# EAGLE design Cytrill (EAGLE 6.5.0)
DATABASE: ./parts-db.csv
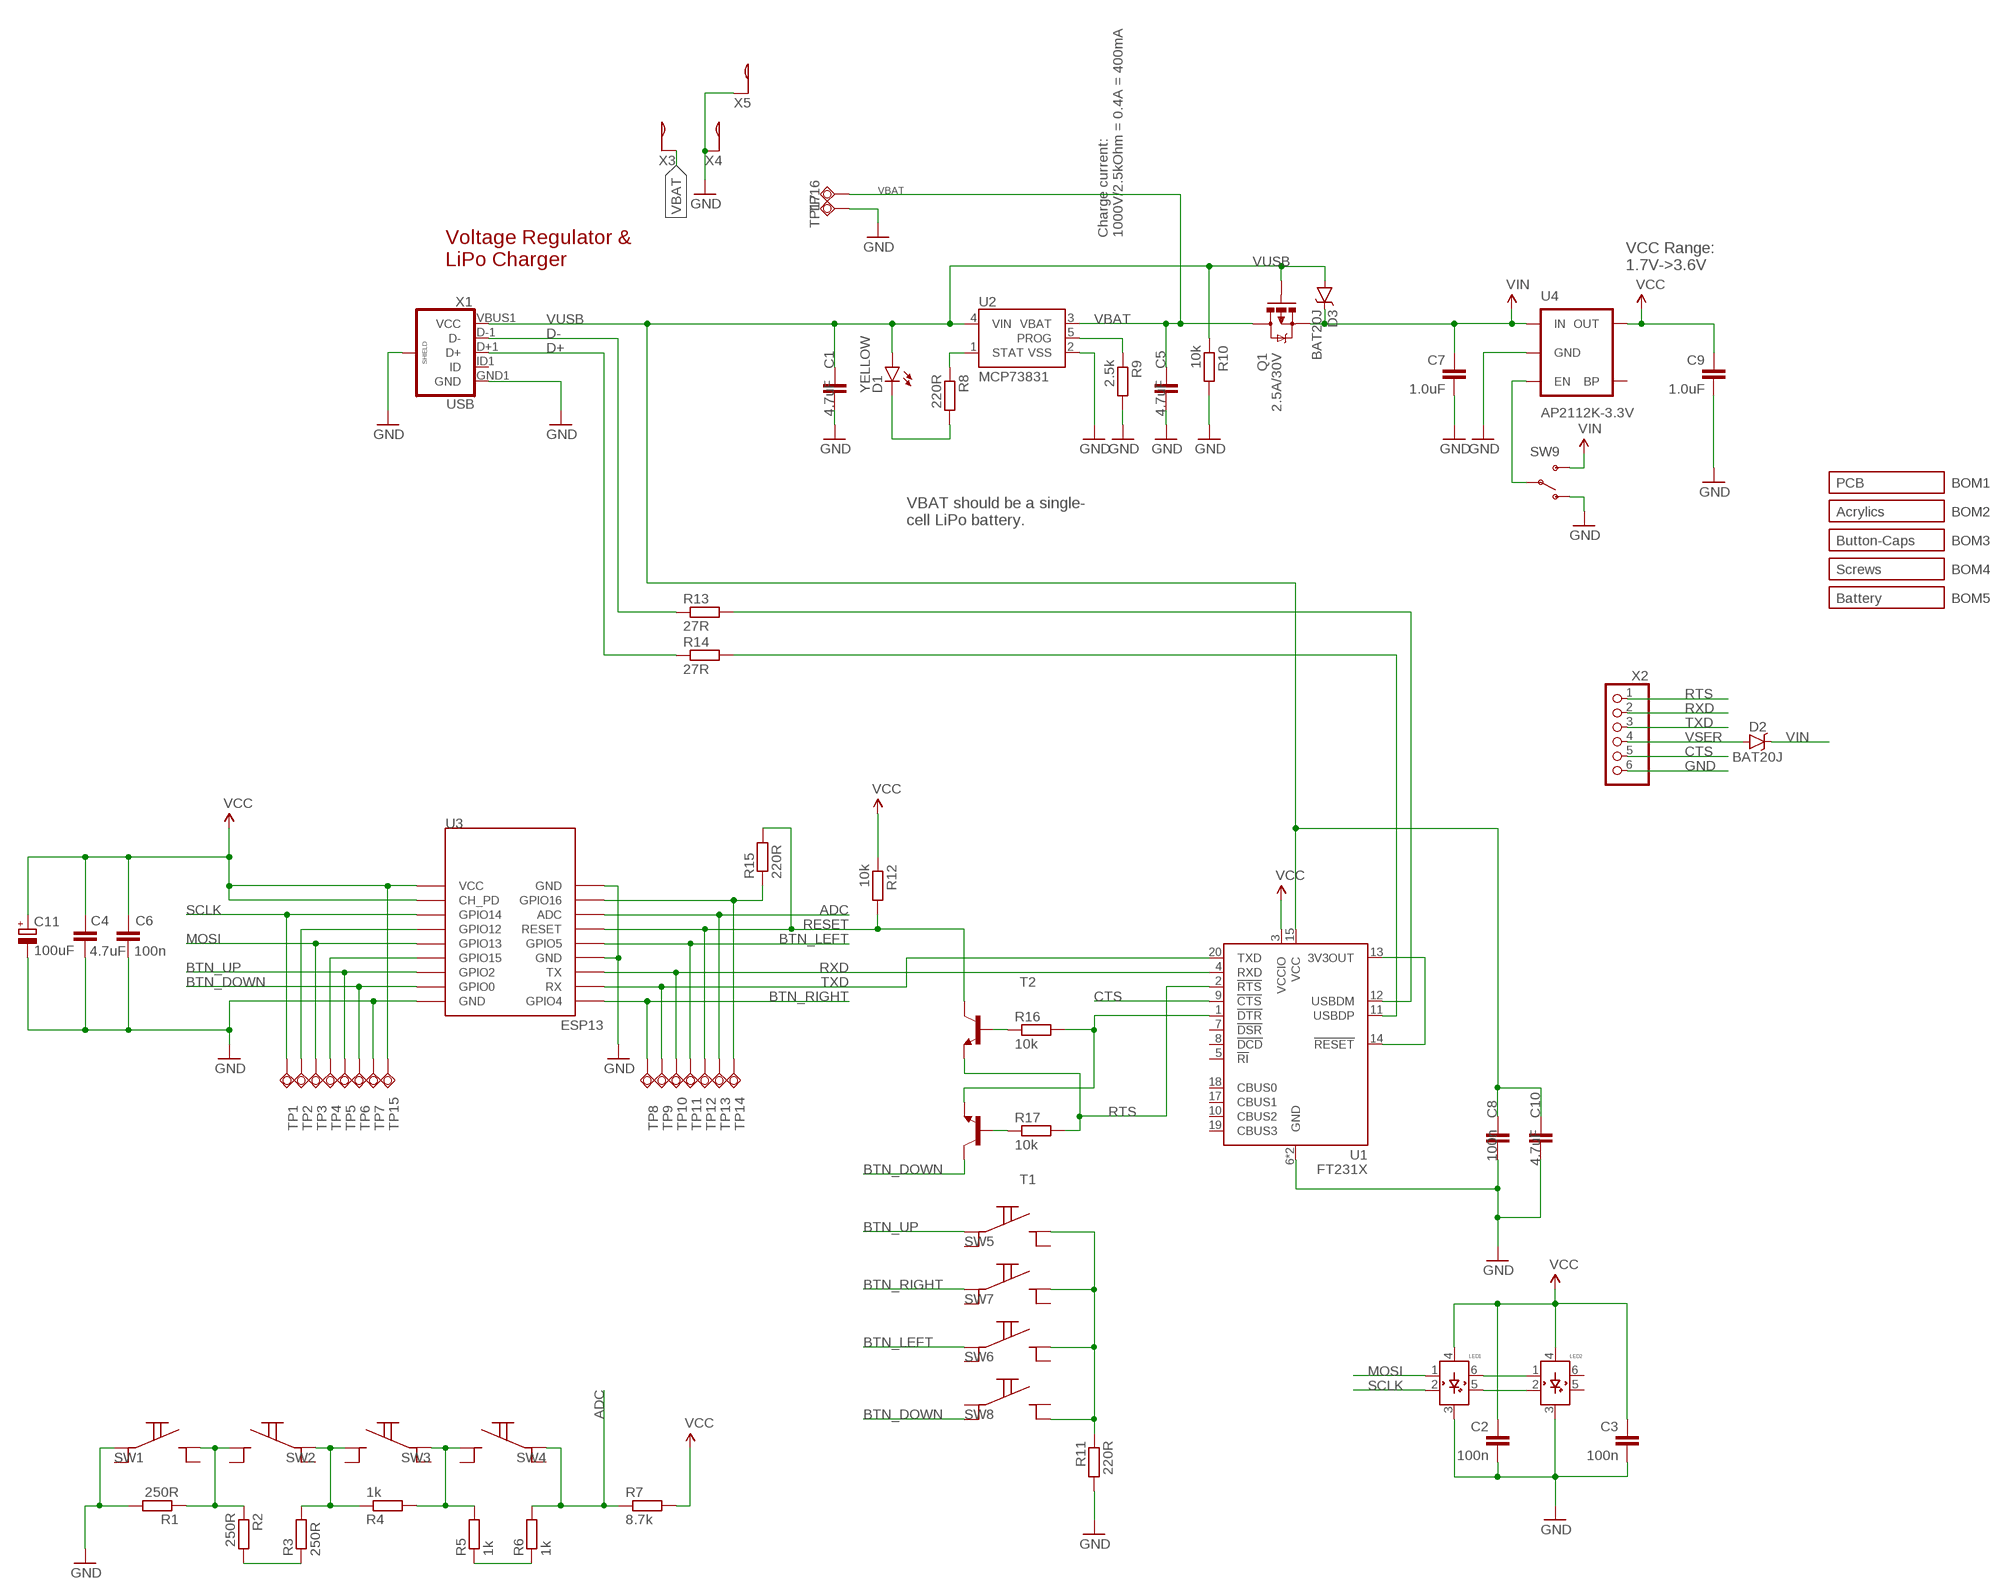
[diagram p0: schematic, sheet 1]
BOM1 (BOM-ENTRY): PARTNO: PCB100x36
BOM2 (BOM-ENTRY): PARTNO: ACRYLICS
BOM3 (BOM-ENTRY): PARTNO: TACTCAPS
BOM4 (BOM-ENTRY): PARTNO: SCREWS
BOM5 (BOM-ENTRY): PARTNO: BATTERY-AAA

## Parts
C1  4.7uF  C-EUC0603  [C0603]
C2  100n  C-EUC0603  [C0603]
C3  100n  C-EUC0603  [C0603]
C4  4.7uF  C-EUC0603  [C0603]
C5  4.7uF  C-EUC0603  [C0603]
C6  100n  C-EUC0603  [C0603]
C7  1.0uF  C-EUC0603  [C0603]
C8  100n  C-EUC0603  [C0603]
C9  1.0uF  C-EUC0603  [C0603]
C10  4.7uF  C-EUC0603  [C0603]
C11  100uF  CPOL-EU085CS-1AR  [3216-A]
D1  YELLOW  LED-YELLOW0603  [LED-0603]
D2  BAT20J  DIODE-SCHOTTKY-BAT20J  [SOD-323]
D3  BAT20J  DIODE-SCHOTTKY-BAT20J  [SOD-323]
LED1  APA102  [RGBLED5050]
LED2  APA102  [RGBLED5050]
Q1  2.5A/30V  MOSFET-PCHANNELDMG2307L  [SOT23-3]
R1  250R  R-EU_R0603  [R0603]
R2  250R  R-EU_R0603  [R0603]
R3  250R  R-EU_R0603  [R0603]
R4  1k  R-EU_R0603  [R0603]
R5  1k  R-EU_R0603  [R0603]
R6  1k  R-EU_R0603  [R0603]
R7  8.7k  R-EU_R0603  [R0603]
R8  220R  R-EU_R0603  [R0603]
R9  2.5k  R-EU_R0603  [R0603]
R10  10k  R-EU_R0603  [R0603]
R11  220R  R-EU_R0603  [R0603]
R12  10k  R-EU_R0603  [R0603]
R13  27R  R-EU_R0603  [R0603]
R14  27R  R-EU_R0603  [R0603]
R15  220R  R-EU_R0603  [R0603]
R16  10k  R-EU_R0603  [R0603]
R17  10k  R-EU_R0603  [R0603]
SW1  TACTSWITCH6MM  [TACTSWITCH]
SW2  TACTSWITCH6MM  [TACTSWITCH]
SW3  TACTSWITCH6MM  [TACTSWITCH]
SW4  TACTSWITCH6MM  [TACTSWITCH]
SW5  TACTSWITCH6MM  [TACTSWITCH]
SW6  TACTSWITCH6MM  [TACTSWITCH]
SW7  TACTSWITCH6MM  [TACTSWITCH]
SW8  TACTSWITCH6MM  [TACTSWITCH]
SW9  SWITCH-SPDT-SMD-A  [SWITCH-SPST-SMD-A]
T1  BC847C-NPN-SOT23-BEC  [SOT23-BEC]
T2  BC847C-NPN-SOT23-BEC  [SOT23-BEC]
TP1  TPSQTP15SQ  [TP15SQ]
TP2  TPSQTP15SQ  [TP15SQ]
TP3  TPSQTP15SQ  [TP15SQ]
TP4  TPSQTP15SQ  [TP15SQ]
TP5  TPSQTP15SQ  [TP15SQ]
TP6  TPSQTP15SQ  [TP15SQ]
TP7  TPSQTP15SQ  [TP15SQ]
TP8  TPSQTP15SQ  [TP15SQ]
TP9  TPSQTP15SQ  [TP15SQ]
TP10  TPSQTP15SQ  [TP15SQ]
TP11  TPSQTP15SQ  [TP15SQ]
TP12  TPSQTP15SQ  [TP15SQ]
TP13  TPSQTP15SQ  [TP15SQ]
TP14  TPSQTP15SQ  [TP15SQ]
TP15  TPSQTP15SQ  [TP15SQ]
TP16  TPSQTP20R  [TP20R]
TP17  TPSQTP20R  [TP20R]
U1  FT231X  [SSOP20]
U2  MCP73831  [SOT23-5]
U3  ESP13  [ESP13]
U4  AP2112K-3.3V  V_REG_LDOSMD  [SOT23-5]
X1  USB  USB_MICROB_PLUGCONN-11752  [USB-B-MICRO-SMD_V03]
X2  PINHD-1X6/90-SMD  [1X06/90-SMD]
X3  BATTERYTERMINAL  [KEYSTONE-55]
X4  BATTERYTERMINAL  [KEYSTONE-55]
X5  BATTERYTERMINAL  [KEYSTONE-55]

## Nets
ADC: R6.2 R7.1 SW4.A@1(A) TP13.TP U3.ADC
BTN_DOWN: SW8.A@2(A1) T1.3(C) TP6.TP U3.GPIO0
BTN_LEFT: SW6.A@1(A) TP11.TP U3.GPIO5
BTN_RIGHT: SW7.A@1(A) TP8.TP U3.GPIO4
BTN_UP: SW5.A@1(A) TP5.TP U3.GPIO2
CTS: U1.9(!CTS) X2.5
D+: R14.1 X1.D+1(D+)
D-: R13.1 X1.D-1(D-)
GND: C1.2 C2.2 C3.2 C4.2 C5.2 C6.2 C7.2 C8.2 C9.2 C10.2 C11.- LED1.3(GND) LED2.3(GND) R1.2 R9.2 R10.2 R11.2 SW1.A@1(A) SW9.1(O) TP7.TP TP17.TP U1.6(GND) U1.16(GND) U2.2(VSS) U3.GND@0(GND) U3.GND@1(GND) U3.GND@2(GND) U4.2(GND) X1.GND1(GND) X1.SHIELD1(SHIELD) X1.SHIELD2(SHIELD) X2.6 X4.1@1 X4.1@2 X5.1@1 X5.1@2
MOSI: LED1.1(DIN) TP3.TP U3.GPIO13
N$1: LED1.6(DOUT) LED2.1(DIN)
N$2: LED1.5(COUT) LED2.2(CIN)
N$3: R11.1 SW5.B@1(B) SW6.B@1(B) SW7.B@1(B) SW8.B@2(B1)
N$4: R14.2 U1.11(USBDP)
N$5: R15.1 TP14.TP U3.GPIO16
N$6: R1.1 R2.1 SW1.B@1(B) SW2.B@1(B)
N$7: R3.2 R4.1 SW2.A@1(A) SW3.B@1(B)
N$8: R4.2 R5.2 SW3.A@1(A) SW4.B@1(B)
N$9: R13.2 U1.12(USBDM)
N$10: U1.13(3V3OUT) U1.14(!RESET)
N$11: SW9.2(P) U4.3(EN)
N$12: R16.1 T2.1(B)
N$13: R5.1 R6.1
N$14: R9.1 U2.5(PROG)
N$15: R2.2 R3.1
N$16: TP2.TP U3.GPIO12
N$17: D1.C R8.2
N$18: R8.1 U2.1(STAT)
N$19: TP4.TP U3.GPIO15
N$21: R17.1 T1.1(B)
N$23: R16.2 T1.2(E) U1.1(!DTR)
RESET: R12.2 R15.2 T2.3(C) TP12.TP U3.RST(RESET)
RTS: R17.2 T2.2(E) U1.2(!RTS) X2.1
RXD: TP10.TP U1.4(RXD) U3.TXD(TX) X2.2
SCLK: LED1.2(CIN) TP1.TP U3.GPIO14
TXD: TP9.TP U1.20(TXD) U3.RXD(RX) X2.3
VBAT: C5.1 Q1.3(D) TP16.TP U2.3(VBAT) X3.1@1 X3.1@2
VCC: C2.1 C3.1 C4.1 C6.1 C9.1 C11.+ LED1.4(VDD) LED2.4(VDD) R7.2 R12.1 TP15.TP U1.3(VCCIO) U3.CH_PD U3.VCC U4.5(OUT)
VIN: C7.1 D2.C D3.C Q1.2(S) SW9.3(S) U4.1(IN)
VSER: D2.A X2.4
VUSB: C1.1 C8.1 C10.1 D1.A D3.A Q1.1(G) R10.1 U1.15(VCC) U2.4(VIN) X1.VBUS1(VCC)
Unconnected: LED2.5(COUT) LED2.6(DOUT) SW1.A@2(A1) SW1.B@2(B1) SW2.A@2(A1) SW2.B@2(B1) SW3.A@2(A1) SW3.B@2(B1) SW4.A@2(A1) SW4.B@2(B1) SW5.A@2(A1) SW5.B@2(B1) SW6.A@2(A1) SW6.B@2(B1) SW7.A@2(A1) SW7.B@2(B1) SW8.A@1(A) SW8.B@1(B) U1.5(!RI) U1.7(!DSR) U1.8(!DCD) U1.10(CBUS2) U1.17(CBUS1) U1.18(CBUS0) U1.19(CBUS3) U4.4(BP) X1.ID1(ID)

## Notes on the sheet
- Charge current:
  1000V/2.5kOhm = 0.4A = 400mA
- Voltage Regulator &
  LiPo Charger
- VCC Range:
  1.7V->3.6V
- VBAT should be a single-
  cell LiPo battery.

## Library data of the parts
C1 C4 C5 C10 = Cytrill:C-EU: CAPACITOR, European symbol; PARTNO: GRM188R61A475KE15D-MO
C2 C3 C6 C8 = Cytrill:C-EU: CAPACITOR, European symbol; PARTNO: C0603C104K4RACTU-MO
C7 C9 = Cytrill:C-EU: CAPACITOR, European symbol; PARTNO: GRM188R61E105KA12D-MO
C11 = Cytrill:CPOL-EU: POLARIZED CAPACITOR, European symbol; PARTNO: TANTAL100UF
D1 = Cytrill:LED-YELLOW: Yellow SMD LEDs LilyPad 1206- DIO-09909 0603- DIO-09003; PARTNO: LYQ396P1Q236-MO; PROD_ID: DIO-09003
D2 D3 = Cytrill:DIODE-SCHOTTKY: Schottky diodes in SFE's production catalog BAT20J 1A 23V 0.62Vf RB751 120mA 40V 0.37Vf PMEG4005EJ 0.5A 40V 0.42Vf MBRA140 1A 40V 0.5Vf B340A 3A 40V SMA; PARTNO: BAT20JFILM-MO; PROD_ID: DIO-11623
LED1 LED2 = Cytrill:APA102; PARTNO: APA102
Q1 = Cytrill:MOSFET-PCHANNEL: Generic PMOSFET IRLML2244 - TRANS-11153 (SOT-23 -20V -4.3A) (1.Gate 2.Source 3.Drain) FQP27P06 - COM-10349 <http://www.sparkfun.com/products/10349> (TO-220 -60V -27A) (1.Gate 2.Source 3.Drain); PARTNO: DMP3130L-7-MO; PROD_ID: TRANS-11308
R1-R3 = Cytrill:R-EU_: RESISTOR, European symbol; PARTNO: ERJ3EKF2490V-MO
R4-R6 = Cytrill:R-EU_: RESISTOR, European symbol; PARTNO: ERJ3EKF1001V-MO
R7 = Cytrill:R-EU_: RESISTOR, European symbol; PARTNO: ERJ3EKF8661V-MO
R8 R11 R15 = Cytrill:R-EU_: RESISTOR, European symbol; PARTNO: ERJ3EKF2200V-MO
R9 = Cytrill:R-EU_: RESISTOR, European symbol; PARTNO: ERJ3EKF2491V-MO
R10 R12 R16 R17 = Cytrill:R-EU_: RESISTOR, European symbol; PARTNO: ERJ3EKF1002V-MO
R13 R14 = Cytrill:R-EU_: RESISTOR, European symbol; PARTNO: ERJ3EKF27R0V-MO
SW1-SW8 = Cytrill:TACTSWITCH; PARTNO: 101-0364-EV-MO
SW9 = Cytrill:SWITCH-SPDT: SPDT Switch Simple slide switch, Spark Fun Electronics SKU : COM-00102 DPDT SMT slide switch, AYZ0202, SWCH-08179; PARTNO: SSSS810701; PROD_ID: SWCH-10651
T1 T2 = Cytrill:*-NPN-: NPN Transistror BF959 corrected 2008.03.06; PARTNO: BC847C-MO
TP1-TP17 = Cytrill:TPSQ: Test pad; PARTNO: TESTPAD
U1 = Cytrill:FT231X; PARTNO: FT231XS
U2 = Cytrill:MCP73831: Miniature single cell, fully integrated Li-Ion, Li-polymer charge management controller http://ww1.microchip.com/downloads/en/DeviceDoc/21984a.pdf IC-09995; PARTNO: MCP73831T-2ATI/OT; PROD_ID: IC-09995
U3 = Cytrill:ESP13; PARTNO: esp-13
U4 = Cytrill:V_REG_LDO: Voltage Regulator LDO Standard 150mA LDO voltage regulator in SOT-23 layout. Micrel part MIC5205. BP (by-pass) pin is used to lower output noise with 470pF cap.; PARTNO: AP2112K-3.3; PROD_ID: VREG-12457
X1 = Cytrill:USB_MICROB_PLUG: USB Micro-B connectors Some male, some female. Watch your step!; PROD_ID: CONN-11752
X2 = Cytrill:PINHD-1X6: PIN HEADER; PARTNO: 961106-5500-AR-PR-MO
X3-X5 = Cytrill:BATTERYTERMINAL; PARTNO: KS55-MO

## Board
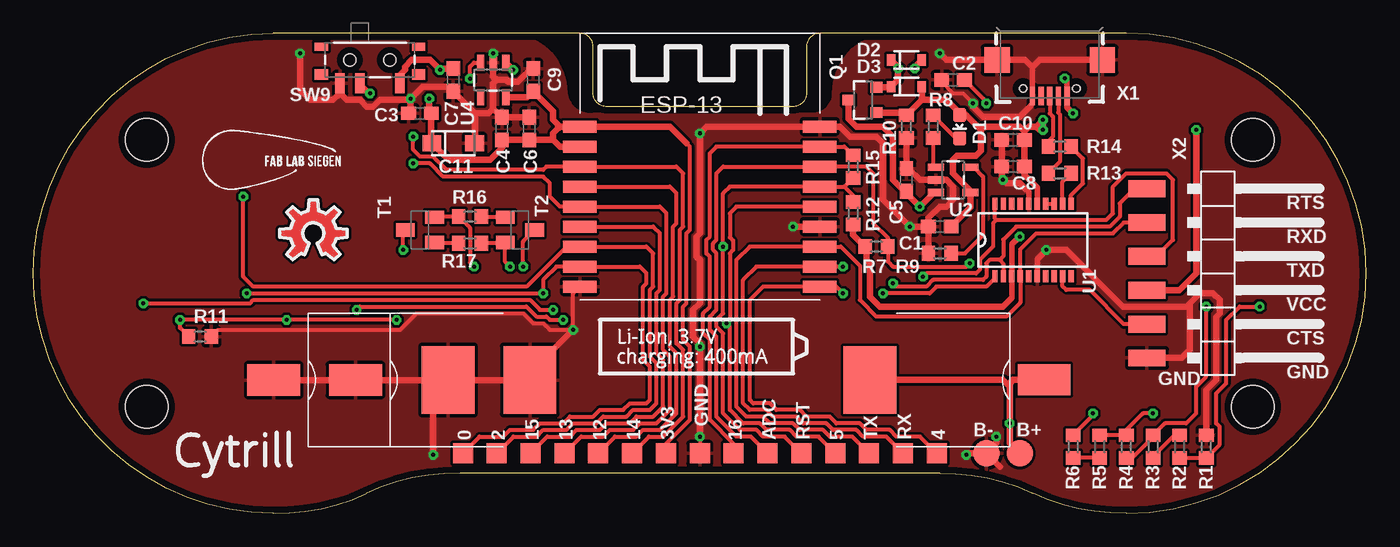
[diagram p1: board, top side]
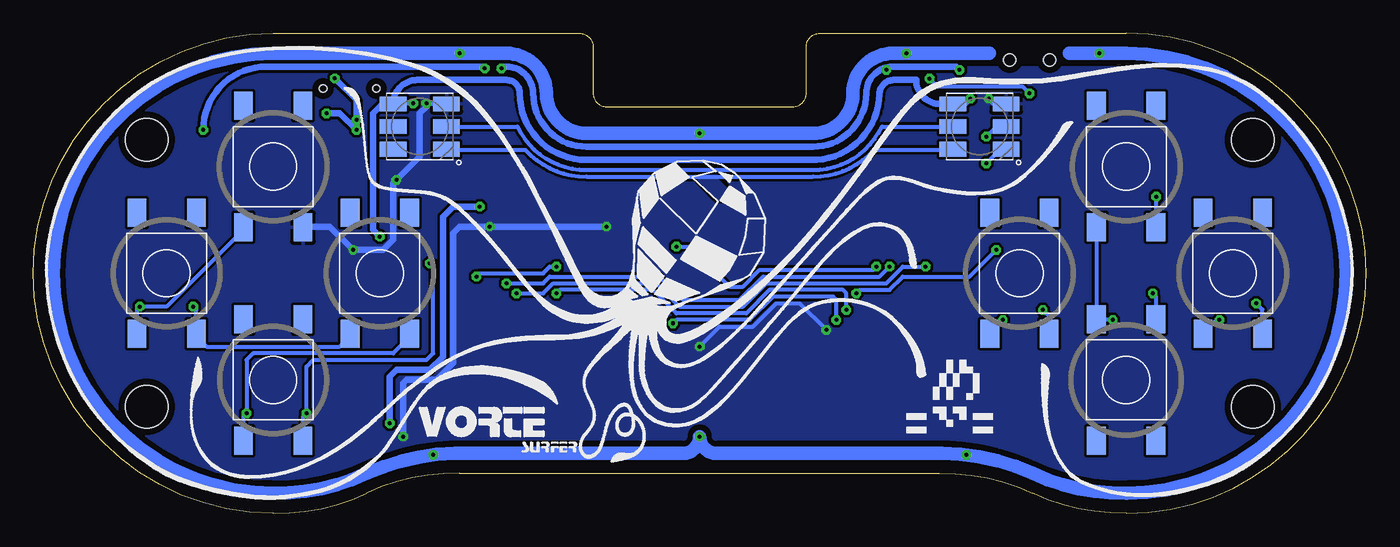
[diagram p2: board, bottom side, seen from below]

Size 100.01 x 36 mm. Coordinates in mm from the lower left corner, seen from the top.
Outline: 59.01,36 arc90 58.01,35 58.01,31.5 arc-90 57.01,30.5 43.01,30.5 arc-90 42.01,31.5 42.01,35 arc90 41.01,36 18.01,36 arc90 0,18 arc90 18.01,0 arc27 25.01,1.5 arc-27 32.01,3 68.01,3 arc-27 75.01,1.5 arc27 82.01,0 arc180 82.01,36 59.01,36
Copper layers (1*16): Top 0.035mm / dielectric 1.5mm / Bottom 0.035mm
Design rules "default *": minimum track width 0.15mm, minimum drill 0.3mm, track to track 0.2mm, track to pad 0.2mm, pad to pad 0.2mm, via to via 0.2mm, smd to smd 0mil, copper to edge 0.5mm, drill to drill 8mil, minimum pad ring 10mil, minimum via ring 8mil, stop-mask expansion 4mil, vias tented up to drill 0.3mm, thermal gap 10mil
Holes 3.2 mm at 91.51,8 91.51,28 8.51,28 8.51,8

### Footprints (pad centres in the part's own frame; a part is rotated, then mirrored left to right if it is on the bottom)
C0603 = smd 1.1 x 1: 1 -0.85,0; 2 0.85,0
3216-A = smd 1.4 x 1.2: + 1.6,0; - -1.6,0
LED-0603 = smd 1 x 1: A 0,-0.877; C 0,0.877
SOD-323 = smd 0.63 x 0.83: A 1.15,0; C -1.15,0
RGBLED5050 = smd 2 x 1.1: 1 -2,1.7; 2 -2,0; 3 -2,-1.7; 4 2,-1.7; 5 2,0; 6 2,1.7
SOT23-3 = smd 0.8 x 0.9: 1 -0.95,-1; 2 0.95,-1; 3 0,1.1
R0603 = smd 1 x 1.1: 1 -0.85,0; 2 0.85,0
TACTSWITCH = smd 2.1 x 1.4: A@1 -4.55,-2.23; A@2 4.55,-2.23; B@1 -4.55,2.23; B@2 4.55,2.23
SWITCH-SPST-SMD-A = smd 0.7 x 1.5: 1 -2.25,-1.75; 2 -0.75,-1.75; 3 2.25,-1.75 | smd 1 x 0.6: GND1 -3.65,1; GND3 3.65,1 | smd 1 x 0.8: GND2 -3.65,-1.1; GND4 3.65,-1.1 | hole 0.9: -1.5,0; 1.5,0
SOT23-BEC = smd 1 x 1.4: 1 -0.95,-1.1; 2 0.95,-1.1; 3 0,1.1
TP15SQ = smd 1.5 x 1.5: TP 0,0
TP20R = smd 2 x 2: TP 0,0
SSOP20 = smd 0.914 x 0.406: 1 -2.718,2.857; 2 -2.718,2.223; 3 -2.718,1.587; 4 -2.718,0.953; 5 -2.718,0.318; 6 -2.718,-0.318; 7 -2.718,-0.953; 8 -2.718,-1.587; 9 -2.718,-2.223; 10 -2.718,-2.857; 11 2.718,-2.857; 12 2.718,-2.223; 13 2.718,-1.587; 14 2.718,-0.953; 15 2.718,-0.318; 16 2.718,0.318; 17 2.718,0.953; 18 2.718,1.587; 19 2.718,2.223; 20 2.718,2.857
SOT23-5 = smd 0.55 x 1.2: 1 -0.95,-1.3; 2 0,-1.3; 3 0.95,-1.3; 4 0.95,1.3; 5 -0.95,1.3
ESP13 = smd 2.5 x 0.9: ADC 9,3; CH_PD -9,4.5; GND@0 -9,-6; GND@1 9,6; GND@2 9,-1.5; GPIO0 -9,-4.5; GPIO2 -9,-3; GPIO4 9,-6; GPIO5 9,0; GPIO12 -9,1.5; GPIO13 -9,0; GPIO14 -9,3; GPIO15 -9,-1.5; GPIO16 9,4.5; RST 9,1.5; RXD 9,-4.5; TXD 9,-3; VCC -9,6
USB-B-MICRO-SMD_V03 = smd 0.4 x 1.4: D+1 0,2.7; D-1 -0.65,2.7; GND1 1.3,2.7; ID1 0.65,2.7; VBUS1 -1.3,2.7 | smd 1.9 x 1.9: SHIELD1 -3.95,0; SHIELD2 3.95,0 | hole 0.55: -2,2.15; 2,2.15
1X06/90-SMD = smd 1.27 x 2.77: 1 -6.35,-5.45; 2 -3.81,-5.45; 3 -1.27,-5.45; 4 1.27,-5.45; 5 3.81,-5.45; 6 6.35,-5.45
KEYSTONE-55 = smd 3.96 x 5.08: 1@1 11.105,-0.007 | smd 3.96 x 2.34: 1@2 -1.975,-0.007

### Placement (x,y rotation side)
C1  68.01,21.5 180 top
C2  69.01,32.5 180 top
C3  29.01,30 180 top
C4  35.16,28.85 90 top
C5  65.51,25 90 top
C6  37.21,28.85 90 top
C7  31.51,32.5 270 top
C8  73.51,26 180 top
C9  37.51,32.5 90 top
C10  73.51,28 180 top
C11  31.51,27.75 180 top
D1  69.51,29 180 top
D2  65.51,34 0 top
D3  65.51,32 0 top
LED1  29.01,29 180 bottom
LED2  71.01,29 180 bottom
Q1  62.26,31 90 top
R1  88.01,5 90 top
R2  86.01,5 90 top
R3  84.01,5 90 top
R4  82.01,5 90 top
R5  80.01,5 90 top
R6  78.01,5 90 top
R7  63.26,20 180 top
R8  67.51,29 90 top
R9  68.01,19.5 180 top
R10  65.51,29 270 top
R11  12.51,13.25 0 top
R12  61.51,22.5 90 top
R13  77.01,25.5 0 top
R14  77.01,27.5 0 top
R15  61.51,26 270 top
R16  32.76,22.25 180 top
R17  32.76,20.25 0 top
SW1  82.01,26 90 bottom
SW2  90.01,18 90 bottom
SW3  74.01,18 90 bottom
SW4  82.01,10 90 bottom
SW5  18.01,26 90 bottom
SW6  26.01,18 90 bottom
SW7  10.01,18 90 bottom
SW8  18.01,10 90 bottom
SW9  25.26,34 0 top
T1  29.01,21.25 90 top
T2  36.51,21.25 270 top
TP1  44.93,4.5 270 top
TP2  42.39,4.5 270 top
TP3  39.85,4.5 270 top
TP4  37.31,4.5 270 top
TP5  34.77,4.5 270 top
TP6  32.23,4.5 270 top
TP7  50.01,4.5 270 top
TP8  67.79,4.5 270 top
TP9  65.25,4.5 270 top
TP10  62.71,4.5 270 top
TP11  60.17,4.5 270 top
TP12  57.63,4.5 270 top
TP13  55.09,4.5 270 top
TP14  52.55,4.5 270 top
TP15  47.47,4.5 270 top
TP16  74.01,4.5 0 top
TP17  71.51,4.5 0 top
U1  75.01,20.5 90 top
U2  69.01,25 270 top
U3  50.01,23 0 top
U4  34.51,32.5 180 top
U$1  [FABLAB-KLEIN]  16.26,26.5 0 top
U$2  [SIMON-LOGO]  11.01,21 0 top
U$3  [HASII]  31.01,7 0 bottom
U$4  [VORTEX-KLEIN.1]  65.01,6.25 0 bottom
U$5  [OSHWLOGO_TOP_0.2]  21.01,21 0 top
U$6  [OCTO]  49.91,17.6 0 bottom
X1  76.26,34 180 top
X2  89.01,18 270 top
X3  73.87,10 180 top
X4  26.15,10 0 top
X5  20.01,10 0 top

### Tracks (layer width: path | path; a pad name or v marks a point on that pad's centre or on a via)
ADC  (via drill 0.3)
  Top 0.3: v79.51,7.5 79.51,7.35 R6.2 | TP13.TP 53.84,5.75 52.76,5.75 51.26,7.25 51.26,13.25 50.76,13.75 50.76,14.75 51.26,15.25 51.26,19.5 51.01,19.75 51.01,20.25 51.26,20.5 51.26,25.5 51.76,26 U3.ADC 62.51,26 63.01,25.5 63.01,21.75 64.11,20.65 R7.1 64.11,18.9 64.51,18.5 70.01,18.5 v70.26,18.75
  Bottom 0.3: SW4.A@1 79.78,7.23 v79.51,7.5 79.51,11 79.01,11.5 70.51,11.5 70.01,12 70.01,18.5 v70.26,18.75
BTN_DOWN  (via drill 0.3)
  Top 0.3: TP6.TP 33.48,5.75 35.26,5.75 35.76,6.25 37.51,6.25 38.01,6.75 39.76,6.75 40.26,7.25 42.01,7.25 42.51,7.75 44.26,7.75 44.76,8.25 46.01,8.25 46.26,8.5 46.26,11 45.76,11.5 45.76,17 46.01,17.25 46.01,18 45.51,18.5 U3.GPIO0 39.26,18.5 38.26,17.5 v38.26,16.5 v16.01,16.5 | v27.76,19.75 27.76,21.1 T1.3
  Bottom 0.3: v16.01,16.5 15.78,16.27 SW8.A@2 | v38.26,16.5 38.01,16.75 35.76,16.75 34.76,17.75 29.76,17.75 v27.76,19.75
BTN_LEFT  (via drill 0.3)
  Top 0.3: TP11.TP 58.92,5.75 57.26,5.75 56.76,6.25 55.01,6.25 54.51,6.75 53.26,6.75 52.26,7.75 52.26,14 v52.01,14.25 52.26,14.5 52.26,19.5 52.51,19.75 52.51,20.45 52.26,20.7 52.26,22.5 52.76,23 U3.GPIO5 | v24.26,15.25 24.51,15.5 37.01,15.5 37.76,14.75 38.51,14.75 38.76,14.5 v39.76,14.5
  Bottom 0.3: SW6.A@1 23.78,14.77 v24.26,15.25 | v39.76,14.5 39.76,16 40.01,16.25 44.51,16.25 46.26,14.5 51.76,14.5 v52.01,14.25
BTN_RIGHT  (via drill 0.3)
  Top 0.3: TP8.TP 66.54,5.75 64.76,5.75 64.26,6.25 62.51,6.25 62.01,6.75 60.26,6.75 59.76,7.25 58.01,7.25 57.51,7.75 55.76,7.75 55.26,8.25 54.01,8.25 53.76,8.5 53.76,16 54.76,17 U3.GPIO4 60.26,17 v60.76,16.5 | v8.26,15.75 16.26,15.75 16.51,16 37.26,16 38.01,15.25 v39.01,15.25
  Bottom 0.3: SW7.A@1 7.78,15.27 v8.26,15.75 | v39.01,15.25 39.01,16.5 39.26,16.75 44.76,16.75 46.51,15 51.76,15 53.51,16.75 60.51,16.75 v60.76,16.5
BTN_UP  (via drill 0.3)
  Top 0.3: TP5.TP 36.02,5.75 37.76,5.75 38.26,6.25 40.01,6.25 40.51,6.75 42.26,6.75 42.76,7.25 44.51,7.25 45.01,7.75 46.26,7.75 46.76,8.25 46.76,11.25 46.26,11.75 46.26,16.75 46.51,17 46.51,19.5 46.01,20 U3.GPIO2 40.01,20 37.01,17 16.51,17 15.76,17.75 v15.76,23.75
  Bottom 0.3: v15.76,23.75 15.78,23.73 SW5.A@1
CTS
  Top 0.3: X2.5 81.82,14.19 79.26,16.75 77.51,16.75 77.23,17.03 U1.9
D+
  Top 0.3: X1.D+1 76.26,30 76.51,29.75 76.51,28.25 76.26,28 76.26,27.6 R14.1
D-
  Top 0.3: R13.1 77.01,26.35 77.01,29.95 76.91,30.05 X1.D-1
GND  (via drill 0.3)
  Top 0.3: C2.2 68.16,32.35 69.01,31.5 69.76,31.5 v70.51,30.75 | R11.2 13.86,13.75 27.51,13.75 28.76,15 36.76,15 37.51,14.25 38.26,14.25 38.76,13.75 v40.51,13.75 40.51,16.5 U3.GND@0 | v50.01,5.75 TP7.TP
  Top 0.4: U1.16 74.69,24.07 74.44,24.32 | U1.6 75.33,19.07 75.51,19.25 | 75.01,33.5 74.96,33.45 X1.GND1 74.96,30.7 74.76,30.5
  Top 0.5: C10.2 C8.2 72.66,25.1 v72.76,25 73.01,24.75 74.01,24.75 74.44,24.32 | R10.2 C5.2 65.66,25.85 66.51,25 U2.2 68.51,25 69.01,24.5 69.01,23.5 68.51,23 68.01,23 67.16,22.15 C1.2 | R9.2 C1.2 | C3.2 28.31,30.15 v28.31,31.1 | C9.2 37.36,33.35 36.38,32.38 35.63,32.38 35.51,32.5 34.76,32.5 | 34.76,32.5 34.51,32.75 U4.2 v34.51,34.5 | 75.51,19.25 v76.01,19.75 77.51,19.75 81.76,15.5 86.51,15.5 86.76,15.75 | X1.SHIELD1 75.51,34 75.01,33.5 | 74.96,33.45 74.41,34 X1.SHIELD2 68.51,34 v68.01,34.5 | 74.76,30.5 74.01,29.75 71.26,29.75 70.51,30.5 v70.51,30.75 | X2.6 86.16,11.65 86.76,12.25 86.76,15.75 | 86.76,15.75 87.51,16.5 88.51,16.5 89.01,16 89.01,15 88.76,14.75 88.76,10 88.01,9.25 R1.2 | v57.01,21.5 U3.GND@2 | C1.2 v65.76,21.5 63.76,23.5 63.76,27.75 63.26,28.25 61.26,28.25 60.51,29 U3.GND@1 50.51,29 v50.01,28.5 50.01,21 49.76,20.75 49.76,19.25 50.01,19 50.01,15.75 49.51,15.25 49.51,13.25 50.01,12.75 v50.01,12.5 v50.01,5.75 | v28.31,31.1 29.21,32 31.16,32 C7.2 33.16,30 | SW9.1 23.01,31.5 | 23.01,31.5 23.51,31 24.51,31 25.01,30.5 25.51,30.5 26.01,31 28.21,31 v28.31,31.1 | C6.2 C4.2 34.51,30.35 | 34.51,30.35 34.51,32.25 34.76,32.5 | 33.16,30 34.16,30 34.51,30.35 | v20.01,34.5 20.01,31.75 20.76,31 22.51,31 23.01,31.5 | X5.1@1 X4.1@1 37.25,10.49 v40.51,13.75 | X5.1@1 30.51,9.99 30.39,9.87 | v70.01,4.38 70.13,4.5 TP17.TP | v30.01,4.38 30.01,9.49 | 30.01,9.49 30.39,9.87 | 30.01,9.49 30.01,9.5 29.51,10 29.5,9.99 X4.1@2 X5.1@2 | v72.26,5.75 72.26,5.25 TP17.TP | 33.16,30 33.16,27.8 C11.- | X5.1@1 30.39,9.99 30.39,9.87 | TP17.TP 72.51,3.5
  Bottom 0.3: v70.51,30.75 70.46,30.7 LED2.3 | v50.01,12.5 48.51,14 46.01,14 44.26,15.75 42.51,15.75 v40.51,13.75
  Bottom 0.5: LED1.3 27.91,30.7 v28.31,31.1 | SW1.A@1 79.78,21.48 79.76,21.5 77.76,21.5 v76.01,19.75 73.76,19.75 73.01,20.5 73.01,24.75 v72.76,25 71.01,26.75 71.01,30 70.51,30.5 v70.51,30.75 | v57.01,21.5 v65.76,21.5 68.01,21.5 68.51,21 68.51,11.26 69.76,10.01 72.01,10.01 72.26,9.76 v72.26,5.75
  Bottom 1: 28.26,34.5 v34.51,34.5 35.51,34.5 arc-90 38.51,31.5 arc90 41.51,28.5 v50.01,28.5 58.51,28.5 arc90 61.51,31.5 arc-90 64.51,34.5 v68.01,34.5 82.01,34.5 arc-90 98.51,18 arc-90 82.01,1.5 arc-27 75.01,3 arc27 67.01,4.5 51.26,4.5 arc-90 v50.01,5.75 arc-90 48.76,4.5 33.26,4.5 arc27 25.01,3 arc-27 18.01,1.5 arc-90 1.51,18 arc-90 18.01,34.5 v20.01,34.5 22.26,34.5
  pour Top: 82.01,36 arc-90 100.01,18 arc-90 82.01,0 arc-27 75.01,1.5 arc24 68.01,3 32.01,3 arc27 25.01,1.5 arc-27 18.01,0 arc-90 0.01,18 arc-90 18.01,36 35.51,36 arc-90 40.01,31.5 arc90 42.01,30 58.51,30 arc90 60.01,31.5 arc-90 64.51,36
  pour Bottom (rank 2): 48.76,5.5 arc90 49.01,5.75 arc-90 50.01,6.75 arc-90 51.01,5.75 arc90 51.26,5.5 67.01,5.5 arc-27 75.08,4 arc27 82.01,2.5 arc90 97.51,18 arc90 82.01,33.5 64.51,33.5 arc90 62.51,31.5 arc-90 58.51,27.5 41.51,27.5 arc-90 37.51,31.5 arc90 35.51,33.5 18.01,33.5 arc90 2.51,18 arc90 18.01,2.5 arc27 24.94,4 arc-27 33.01,5.5
MOSI  (via drill 0.3)
  Top 0.3: TP3.TP 41.1,5.75 42.76,5.75 43.26,6.25 45.01,6.25 45.51,6.75 46.76,6.75 47.76,7.75 47.76,11.75 47.26,12.25 47.26,16.25 47.51,16.5 47.51,22.5 47.01,23 U3.GPIO13 39.51,23 38.76,23.75 38.76,24.75 38.26,25.25 30.76,25.25 29.76,26.25 v28.51,26.25
  Bottom 0.3: v28.51,26.25 27.46,27.3 LED1.1
N$1
  Bottom 0.3: LED2.1 arc-90 68.96,27.25 63.1,27.25 arc-47 58.51,25.25 41.51,25.25 arc-47 36.92,27.25 31.06,27.25 arc-90 LED1.6
  pour Bottom: 50.01,25.25 50.01,25 48.51,23.5 48.01,24 48.01,24.25 48.76,25 48.76,25.25
N$2
  Bottom 0.3: LED2.2 63.69,29 arc-64 58.51,25.75 41.51,25.75 arc-64 36.33,29 LED1.5
N$3  (via drill 0.3)
  Top 0.3: v27.26,14.5 v19.01,14.5 v11.01,14.5 11.01,13.9 R11.1
  Bottom 0.3: SW5.B@1 SW8.B@2 20.19,14.5 v19.01,14.5 | SW6.B@1 28.24,13.52 v27.26,14.5 | v11.01,14.5 11.19,14.5 SW7.B@1
N$4
  Top 0.3: U1.11 77.87,23.86 78.76,24.75 78.76,26.6 R14.2
N$5
  Top 0.3: R15.1 60.86,27.5 U3.GPIO16 51.26,27.5 50.76,27 50.76,20.75 50.51,20.5 50.51,19.5 50.76,19.25 50.76,15.5 50.26,15 50.26,13.5 50.76,13 50.76,7 52.55,5.21 TP14.TP
N$6  (via drill 0.3)
  Top 0.3: R2.1 R1.1 89.01,5.15 89.01,6.5 88.76,6.75 88.76,9 89.51,9.75 89.51,14.5 90.51,15.5 v92.01,15.5
  Bottom 0.3: SW2.B@1 92.24,15.27 v92.01,15.5 90.01,15.5 84.24,21.27 SW1.B@1
N$7  (via drill 0.3)
  Top 0.3: v88.01,15.5 88.01,10.25 87.26,9.5 87.26,7.5 86.51,6.75 84.91,6.75 R3.2 84.01,5.7 82.46,4.15 R4.1
  Bottom 0.3: v88.01,15.5 87.78,15.27 SW2.A@1 87.78,13.27 87.01,12.5 77.01,12.5 76.24,13.27 SW3.B@1
N$8  (via drill 0.3)
  Top 0.3: R5.2 R4.2 82.01,6.25 83.26,7.5 v84.01,7.5
  Bottom 0.3: SW4.B@1 84.24,7.27 v84.01,7.5 84.01,11.5 83.51,12 73.01,12 71.78,13.23 SW3.A@1
N$9
  Top 0.3: U1.12 77.23,24.87 R13.2
N$10
  Top 0.3: U1.14 U1.13
N$11  (via drill 0.3)
  Top 0.3: SW9.2 v25.26,31.5 | v32.76,32.6 32.76,33.5 33.06,33.8 U4.3
  Bottom 0.3: v25.26,31.5 25.76,32 32.16,32 v32.76,32.6
N$12
  Top 0.3: R16.1 35.36,22.25 T2.1
N$13
  Top 0.3: R5.1 R6.1
N$14
  Top 0.3: U2.5 70.56,25.95 71.26,25.25 71.26,20.85 69.91,19.5 R9.1
N$15
  Top 0.3: R3.1 84.01,4.25 85.61,5.85 R2.2
N$16
  Top 0.3: TP2.TP 43.64,5.75 45.26,5.75 45.76,6.25 47.01,6.25 48.26,7.5 48.26,12 47.76,12.5 47.76,16 48.01,16.25 48.01,21.5 48.26,21.75 48.26,24 47.76,24.5 U3.GPIO12
N$17
  Top 0.3: D1.C 69.24,28.12 R8.2
N$18
  Top 0.3: R8.1 67.51,26.15 U2.1
N$19
  Top 0.3: TP4.TP 38.56,5.75 40.26,5.75 40.76,6.25 42.51,6.25 43.01,6.75 44.76,6.75 45.26,7.25 46.51,7.25 47.26,8 47.26,11.5 46.76,12 46.76,16.5 47.01,16.75 47.01,21 46.51,21.5 U3.GPIO15
N$21
  Top 0.3: R17.1 30.16,20.25 T1.1
N$23  (via drill 0.3)
  Top 0.3: U1.1 72.15,17.64 71.51,17 67.76,17 67.26,16.5 v63.76,16.5 | T1.2 30.16,22.25 R16.2 32.76,21.4 32.76,18.8 v33.06,18.5
  Bottom 0.3: v63.76,16.5 61.76,16.5 61.01,17.25 53.26,17.25 51.51,15.5 46.76,15.5 45.01,17.25 36.01,17.25 34.76,18.5 v33.06,18.5
RESET  (via drill 0.3)
  Top 0.3: 60.86,24.5 U3.RST 52.26,24.5 51.76,24 v51.76,20 51.76,15 51.26,14.5 51.26,14 51.76,13.5 51.76,7.5 53.01,6.25 54.26,6.25 54.76,5.75 56.38,5.75 TP12.TP | 60.86,24.5 R15.2 | R12.2 61.51,23.85 60.86,24.5 | v36.76,18.5 36.76,20.4 T2.3
  Bottom 0.3: v51.76,20 50.76,20 47.76,17 46.76,17 45.51,18.25 37.01,18.25 v36.76,18.5
RTS  (via drill 0.3)
  Top 0.3: X2.1 82.61,24.35 81.51,23.25 81.51,22.25 80.76,21.5 73.76,21.5 72.79,20.53 72.79,19.28 72.51,19 | 72.51,19 72.79,18.72 U1.2 | 72.51,19 71.76,19 71.51,18.75 71.51,17.75 71.26,17.5 67.51,17.5 67.01,17 64.76,17 v64.51,17.25 | v35.76,18.5 35.41,18.85 T2.2 35.36,20.25 R17.2
  Bottom 0.3: v64.51,17.25 61.76,17.25 61.26,17.75 53.01,17.75 51.26,16 47.01,16 45.26,17.75 36.51,17.75 v35.76,18.5
RXD
  Top 0.3: TP10.TP 61.46,5.75 59.76,5.75 59.26,6.25 57.51,6.25 57.01,6.75 55.26,6.75 54.76,7.25 53.51,7.25 52.76,8 52.76,19 53.76,20 U3.TXD 60.59,20 62.01,18.57 62.01,16 63.26,14.75 73.01,14.75 74.06,15.8 U1.4 74.06,19.8 75.26,21 81.01,21 81.82,21.81 X2.2
SCLK  (via drill 0.3)
  Top 0.3: TP1.TP 46.18,5.75 47.26,5.75 48.76,7.25 48.76,12.25 48.26,12.75 48.26,15.75 48.51,16 48.51,21.25 48.76,21.5 48.76,25.5 48.26,26 U3.GPIO14 38.51,26 38.26,25.75 31.01,25.75 30.01,26.75 29.01,26.75 28.51,27.25 v28.51,28.25
  Bottom 0.3: LED1.2 27.76,29 v28.51,28.25
TXD  (via drill 0.3)
  Top 0.3: X2.3 84.28,19.27 85.51,20.5 85.51,25 85.01,25.5 82.01,25.5 81.01,24.5 81.01,22.5 80.51,22 72.26,22 | 72.26,22 72.15,22.11 U1.20 | TP9.TP 64,5.75 62.26,5.75 61.76,6.25 60.01,6.25 59.51,6.75 57.76,6.75 57.26,7.25 55.51,7.25 55.01,7.75 53.76,7.75 53.26,8.25 53.26,17.5 54.26,18.5 U3.RXD v60.76,18.5 | 72.26,22 72.01,21.75 72.01,20 71.01,19 71.01,18.25 70.76,18 67.01,18 v66.76,17.75
  Bottom 0.3: v66.76,17.75 66.51,18 61.76,18 61.26,18.5 v60.76,18.5
VBAT  (via drill 0.3)
  Top 0.5: 65.61,24.05 C5.1 | C5.1 65.36,24.15 64.51,25 64.51,28.25 63.76,29 61.76,29 61.16,29.6 Q1.3 | U2.3 67.56,24.05 v66.51,23 65.51,24 C5.1 | TP16.TP 73.26,5.25 v73.26,6.75 73.26,9.5 | 73.26,9.5 73.26,9.75 73.51,10 75.84,10 X3.1@2 | X3.1@1 72.75,10.01 73.26,9.5
  Bottom 0.5: v66.51,23 68.51,23 69.26,22.25 69.26,11.75 70.26,10.75 72.76,10.75 73.26,10.25 v73.26,6.75
VCC  (via drill 0.3)
  Top 0.3: TP15.TP 47.47,5.21 49.26,7 49.26,12.5 48.76,13 48.76,15.5 49.01,15.75 49.01,21 49.26,21.25 49.26,27.5 49.01,27.75 | C2.1 71.51,30.85 v71.51,30.75
  Top 0.4: 73.26,16 73.42,16.16 U1.3 73.42,20.16 73.51,20.25
  Top 0.5: v29.71,31.1 29.71,30.15 C3.1 29.86,27.8 C11.+ 31.16,26.5 34.26,26.5 35.16,27.4 C4.1 C6.1 39.01,28 | 49.01,27.75 47.76,29 U3.VCC 39.51,29 39.38,28.88 | 73.26,16 72.76,15.5 63.51,15.5 62.76,16.25 62.76,18.75 62.51,19 62.51,19.9 R7.2 61.51,20.9 R12.1 | v74.01,20.75 73.51,20.25 | U3.CH_PD 39.51,27.5 39.01,28 | 39.38,28.88 39.01,28.5 39.01,28 | U4.5 37.06,31.2 C9.1 39.01,30.15 39.01,29.5 39.38,29.12 39.38,28.88
  Bottom 0.3: v71.51,30.75 71.56,30.7 LED2.4
  Bottom 0.5: v29.71,31.1 30.11,30.7 LED1.4 31.96,30.7 arc90 33.76,32.5 35.46,32.5 arc-90 36.51,31.45 arc90 41.71,26.5 58.51,26.5 arc90 63.51,31.5 arc-90 64.51,32.5 71.21,32.5 arc-90 LED2.4 73.81,30.7 74.51,30 74.51,21.25 v74.01,20.75
VIN  (via drill 0.3)
  Top 0.5: Q1.2 64.31,31.95 D3.C 64.89,32.52 v64.89,33.38 64.89,33.48 D2.C | SW9.3 27.51,32.88 27.89,33.25 27.89,33.5 28.39,34 29.76,34 v30.51,33.25 30.61,33.35 C7.1 | U4.1 v36.01,33.25 | v36.01,33.25
  Bottom 0.5: 35.51,33.5 arc-90 37.51,31.5 arc90 41.51,27.5 58.51,27.5 arc90 62.51,31.5 arc-90 64.51,33.5 arc-37 v64.89,33.38 | 35.51,33.5 30.76,33.5 v30.51,33.25 | v36.01,33.25 arc70 35.51,33.5
VSER  (via drill 0.3)
  Top 0.5: v87.26,28.75 87.26,18 85.99,16.73 X2.4 | v66.14,33.38 66.14,33.48 D2.A
  Bottom 0.5: v87.26,28.75 arc90 82.51,33.5 66.26,33.5 v66.14,33.38
VUSB  (via drill 0.3)
  Top 0.4: v78.01,30 77.56,30.45 X1.VBUS1 77.56,32.45 v77.39,32.62 | U1.15 75.33,24.43 75.26,24.5
  Top 0.5: 71.11,28.75 71.11,27.2 70.71,26.8 69.31,26.8 69.01,26.5 69.01,25.5 70.31,24.2 U2.4 70.31,22.95 C1.1 | 74.36,28.65 C10.1 C8.1 74.36,25.4 75.26,24.5 | 74.36,28.65 74.01,29 71.36,29 71.11,28.75 | 66.66,31 68.51,31 69.51,30 D1.A 69.98,29.88 71.11,28.75 | 66.66,31 R10.1 65.31,30.05 Q1.1 | 66.66,31 D3.A | 74.36,28.65 74.71,29 75.26,29 | 75.26,29 v75.76,29.5 v75.76,28.75 75.51,28.75 75.26,29
  Bottom 0.5: v77.39,32.62 75.76,31 v75.76,29.5 v75.76,28.75 77.01,30 v78.01,30

### Text on the board
tPlace: RTS | RXD | TXD | VCC | CTS | GND | GND | 0 | 2 | 15 | 13 | 12 | 14 | 3V3 | GND | 16 | ADC | RST | 5 | TX | RX | 4 | B- | B+